# Altium schematic sheet [1]STM32F334R8T6Board_MCU.SchDoc
size B
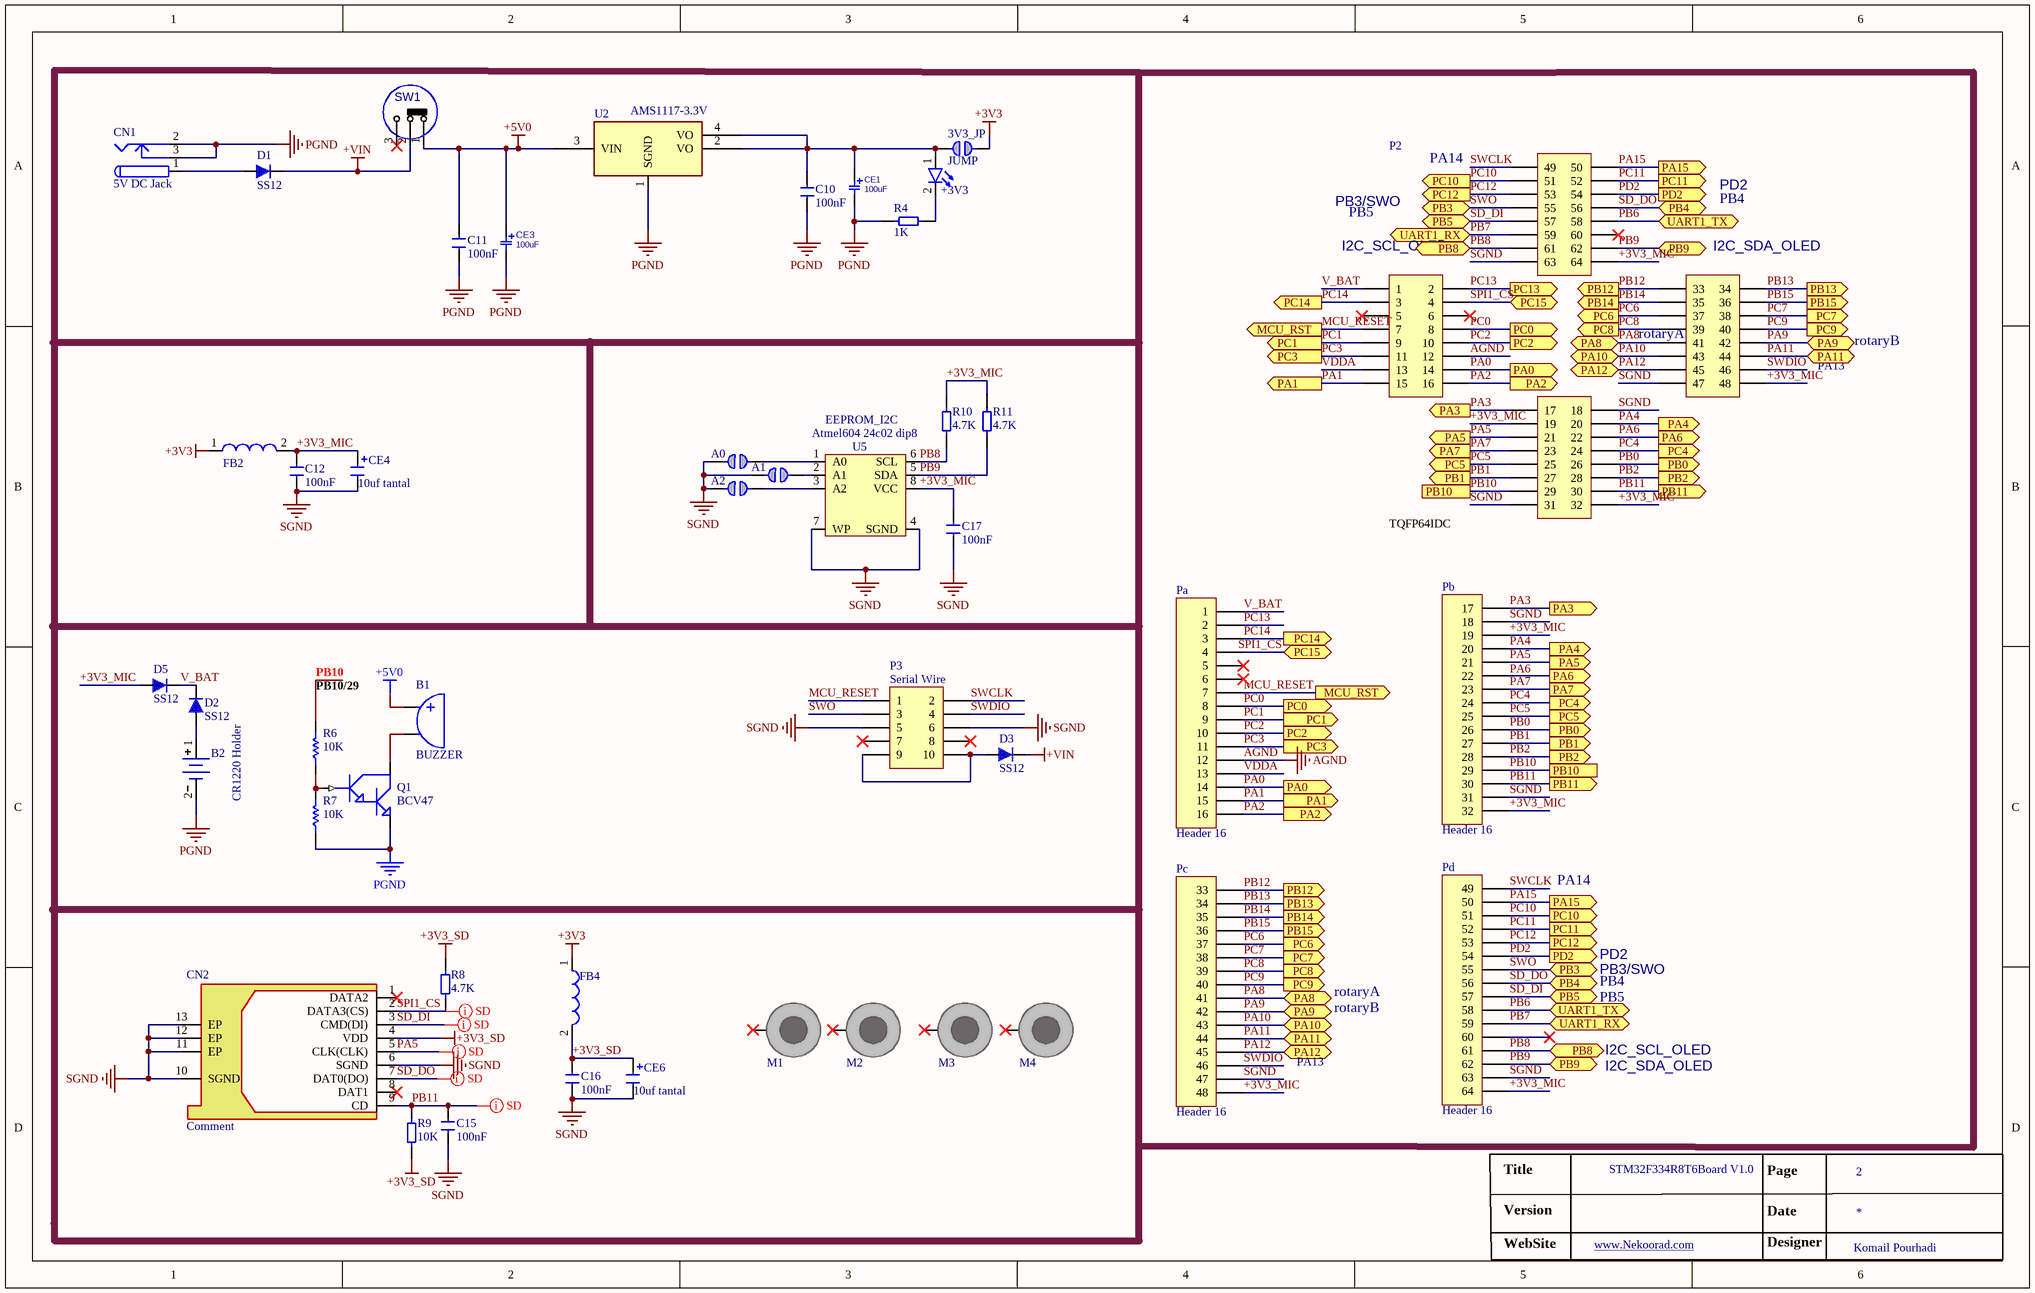
[diagram p0: [1]STM32F334R8T6Board_MCU.SchDoc]

## Parts
3V3_JP  JUMP  [RES_1206]
+3V3  HB  [LED SMD 1206]  (value not drawn)
A0  Comment  [HDR1X2]  (value not drawn)
A1  Comment  [HDR1X2]  (value not drawn)
A2  Comment  [HDR1X2]  (value not drawn)
B1  BUZZER  [BUZZ]
B2  CR1220 Holder  [Battery3]
C10  Comment  [SMD_CAP_1206]  (value not drawn)
C11  Comment  [SMD_CAP_1206]  (value not drawn)
C12  Comment  [SMD_CAP_1206]  (value not drawn)
C15  Comment  [SMD_CAP_1206]  (value not drawn)
C16  Comment  [SMD_CAP_1206]  (value not drawn)
C17  Comment  [SMD_CAP_1206]  (value not drawn)
CE1  value 100uF  [CAP-E-4]  (hidden comment: Comment)
CE3  value 100uF  [CAP-E-4]  (hidden comment: Comment)
CE4  10uf tantal  [cap-e-2]
CE6  10uf tantal  [cap-e-2]
CN1  5V DC Jack  [Power Jack]
CN2  Comment  [Micro sd csrd]
D1  SS12  [Diode SMA-M]
D2  SS12  [Diode SMA-M]
D3  SS12  [Diode SMA-M]
D5  SS12  [Diode SMA-M]
FB2  Comment  [r4p]  (value not drawn)
FB4  Comment  [r4p]  (value not drawn)
M1  Comment  [Stud-hole]  (value not drawn)  (no BOM)
M2  Comment  [Stud-hole]  (value not drawn)  (no BOM)
M3  Comment  [Stud-hole]  (value not drawn)  (no BOM)
M4  Comment  [Stud-hole]  (value not drawn)  (no BOM)
P2  TQFP64IDC  [tqfp64idc]
P3  Serial Wire  [IDC10-BOX]
Pa  Header 16  [HDR1X16]
Pb  Header 16  [HDR1X16]
Pc  Header 16  [HDR1X16]
Pd  Header 16  [HDR1X16]
Q1  BCV47  [SOT23_BEC_M]
R4  Comment  [RES_1206]  (value not drawn)
R6  10K  [RES_1206]
R7  10K  [RES_1206]
R8  Comment  [RES_1206]  (value not drawn)
R9  Comment  [RES_1206]  (value not drawn)
R10  Comment  [RES_1206]  (value not drawn)
R11  Comment  [RES_1206]  (value not drawn)
SW1  SlideSwitch  [HDR1X3]  (value not drawn)
U2  value AMS1117-3.3V  [MP04A_M]  (hidden comment: Comment)
U5  EEPROM_I2C  [dip8]

## Ports
MCU_RST (out), PA0 (out), PA1 (out), PA2 (out), PA3 (out), PA4 (out), PA5 (out), PA6 (out), PA7 (out), PA8 (bidir), PA9 (bidir), PA10 (bidir), PA11 (bidir), PA12 (bidir), PA15 (out), PB0 (out), PB1 (out), PB2 (out), PB3 (bidir), PB4 (bidir), PB5 (bidir), PB8 (bidir), PB9 (bidir), PB10, PB11 (out), PB12 (out), PB13 (out), PB14 (out), PB15 (out), PC0 (out), PC1 (out), PC2 (out), PC3 (out), PC4 (out), PC5 (out), PC6 (out), PC7 (out), PC8 (out), PC9 (out), PC10 (out), PC11 (out), PC12 (out), PC13 (out), PC14 (out), PC15 (bidir), PD2 (out), UART1_RX (bidir), UART1_TX (bidir)

## Nets
+3V3: 3V3_JP.2 FB2.1 FB4.1
+3V3_SD: C16.2 CE6.1 CN2.4(VDD) FB4.2 R8.1 R9.2
+5V0: B1.1 C11.2 CE3.1 SW1.1(P1) U2.3(VIN)
+VIN: D1.2(K) D3.2(K) SW1.2(P3)
AGND: P2.12 Pa.12
PGND: B2.2(-) C10.1 C11.1 CE1.2 CE3.2 CN1.2 CN1.3 Q1.2(E) R4.2 R7.1 U2.1(SGND)
SGND: A0.1 A1.1 A2.1 C12.1 C15.2 C16.1 C17.1 CE4.2 CE6.2 CN2.6(SGND) CN2.10(SGND) CN2.11(EP) CN2.12(EP) CN2.13(EP) P2.18 P2.31 P2.47 P2.63 P3.5 P3.6 Pb.18 Pb.31 Pc.47 Pd.63 U5.4(SGND) U5.7(WP)
+3V3_MIC: C12.2 C17.2 CE4.1 D5.1(A) FB2.2 P2.19 P2.32 P2.48 P2.64 Pb.19 Pb.32 Pc.48 Pd.64 R10.1 R11.1 U5.8(VCC)
MCU_RESET: P2.7 P3.1 Pa.7 ; port MCU_RST
PA0: P2.14 Pa.14 ; port PA0
PA1: P2.15 Pa.15 ; port PA1
PA2: P2.16 Pa.16 ; port PA2
PA3: P2.17 Pb.17 ; port PA3
PA4: P2.20 Pb.20 ; port PA4
PA5: CN2.5(CLK(CLK)) P2.21 Pb.21 ; port PA5
PA6: P2.22 Pb.22 ; port PA6
PA7: P2.23 Pb.23 ; port PA7
PA8: P2.41 Pc.41 ; port PA8
PA9: P2.42 Pc.42 ; port PA9
PA10: P2.43 Pc.43 ; port PA10
PA11: P2.44 Pc.44 ; port PA11
PA12: P2.45 Pc.45 ; port PA12
PA15: P2.50 Pd.50 ; port PA15
PB0: P2.26 Pb.26 ; port PB0
PB1: P2.27 Pb.27 ; port PB1
PB2: P2.28 Pb.28 ; port PB2
PB6: P2.58 Pd.58 ; port UART1_TX
PB7: P2.59 Pd.59 ; port UART1_RX
PB8: P2.61 Pd.61 R10.2 U5.6(SCL) ; port PB8
PB9: P2.62 Pd.62 R11.2 U5.5(SDA) ; port PB9
PB10: P2.29 Pb.29 R6.2 ; port PB10
PB11: C15.1 CN2.9(CD) P2.30 Pb.30 R9.1 ; port PB11
PB12: P2.33 Pc.33 ; port PB12
PB13: P2.34 Pc.34 ; port PB13
PB14: P2.35 Pc.35 ; port PB14
PB15: P2.36 Pc.36 ; port PB15
PC0: P2.8 Pa.8 ; port PC0
PC1: P2.9 Pa.9 ; port PC1
PC2: P2.10 Pa.10 ; port PC2
PC3: P2.11 Pa.11 ; port PC3
PC4: P2.24 Pb.24 ; port PC4
PC5: P2.25 Pb.25 ; port PC5
PC6: P2.37 Pc.37 ; port PC6
PC7: P2.38 Pc.38 ; port PC7
PC8: P2.39 Pc.39 ; port PC8
PC9: P2.40 Pc.40 ; port PC9
PC10: P2.51 Pd.51 ; port PC10
PC11: P2.52 Pd.52 ; port PC11
PC12: P2.53 Pd.53 ; port PC12
PC13: P2.2 Pa.2 ; port PC13
PC14: P2.3 Pa.3 ; port PC14
PD2: P2.54 Pd.54 ; port PD2
SD_DI: CN2.3(CMD(DI)) P2.57 Pd.57 ; port PB5
SD_DO: CN2.7(DAT0(DO)) P2.56 Pd.56 ; port PB4
SPI1_CS: CN2.2(DATA3(CS)) P2.4 Pa.4 R8.2 ; port PC15
SWCLK: P2.49 P3.2 Pd.49
SWDIO: P2.46 P3.4 Pc.46
SWO: P2.55 P3.3 Pd.55 ; port PB3
V_BAT: D2.2(K) D5.2(K) P2.1 Pa.1
VDDA: P2.13 Pa.13
Net3V3_JP_1: 3V3_JP.1 +3V3.1(A) C10.2 CE1.1 U2.2(VO) U2.4(VO)
Net+3V3_2: +3V3.2(K) R4.1
NetA0_2: A0.2 U5.1(A0)
NetA1_2: A1.2 U5.2(A1)
NetA2_2: A2.2 U5.3(A2)
NetB1_2: B1.2 Q1.3(C)
NetB2_1: B2.1(+) D2.1(A)
NetCN1_1: CN1.1 D1.1(A)
NetD3_1: D3.1(A) P3.9 P3.10
NetQ1_1: Q1.1(B) R6.1 R7.2

Not connected (* = marked no-connect by the designer): CN2 1(DATA2)* 8(DAT1)*; M1 1*; M2 1*; M3 1*; M4 1*; P2 5* 6* 60*; P3 7* 8*; Pa 5* 6*; Pd 60*; SW1 3(P4)*

## Layout directives
net class SD_card: PA5, PB11, SD_DI, SD_DO, SPI1_CS

## Notes on the sheet
- (near P2) PA14
- (near P2) PB3/SWO
- (near P2) PB5
- (near P2) PD2
- (near P2) PB4
- (near P2) I2C_SCL_OLED
- (near P2) I2C_SDA_OLED
- (near P2) rotaryA
- PA13
- rotaryB
- Atmel604 24c02 dip8
- PB10/29
- PA14
- PB3/SWO
- PD2
- rotaryA
- PB5
- PB4
- I2C_SCL_OLED
- I2C_SDA_OLED
- Title
- STM32F334R8T6Board V1.0
- Page
- 2
- Version
- WebSite
- www.Nekoorad.com <http://www.Nekoorad.com>
- Date
- Designer
- Komail Pourhadi
- Labels drawn without touching a wire or pin: PA6, SPI1_CS
- (in symbol Capacitor SMD) 100nF
- (in symbol Resistor SMD) 1K; 4.7K; 10K

## Library data of the parts
3V3_JP A0-A2 = jumper SMD
+3V3 = LED: Designer: Saeid Jorablo; Organazation: ControTec; Adding Date: 1387/12/22; Color: HB; Size: SMD 1206
B2 = Battry Backup
C10-C12 C15-C17 = Capacitor SMD
CE1 CE3 = CAP_THD_EL_10u25V: CAP, THD, ELEC, 10uF, 25V; MANF_P#: MANF_PART#; PARAM: 25V; MANF: MANF; PARAM2: PARAM2
CE4 CE6 = Capacitor Tantalium
CN1 = Power Jack
CN2 = Micro SD Card
D1-D3 D5 = 1N4001
FB2 FB4 = Ferrit Bead
M1-M4 = SCMH_M1P6: SCREW mouting, M1.6, 1.6mm diameter and 3.2mm PanHead; VALUE: DNP/MH; ASSEMBLY: DNP
P3 = Header 5X2: Header, 5-Pin, Dual row; LatestRevisionDate: 17-Jul-2002; LatestRevisionNote: Re-released for DXP Platform.; Publisher: Altium Limited
Pa Pb Pc Pd = Header 16: Header, 16-Pin; LatestRevisionDate: 17-Jul-2002; LatestRevisionNote: Re-released for DXP Platform.; Publisher: Altium Limited
Q1 = NPN DAR
R4 R8-R11 = Resistor SMD
R6 R7 = Resistor: Tolerance: 5%; Power: 1/8 W; Value: 10K
SW1 = SWSLIDT_SPDT_S_8X4: SWITCH, SLIDE, SPDT, 8.6X4.3mm, THD; MANF_PART#: OS102011MS2QN1; MANF: C&K; DESC: DESCRIPTION; VALUE: SlideSwitch; ASSEMBLY: ASSEMBLY; PARAM: PARAM; PRICE: 0.4$
U2 = VREG_1117_SOT223: REG, Linear, LDO1V, 0.8A, SOT-223; MANF_P#: LD1117, LM1117, AMS1117, TLV1117, REG1117, NCP1117, LT1117, SPX1117; MANF: TI, ON, ST; PARAM2: 1.2/1.5/1.8/2.5/2.85/3.3/5V; PARAM: LDO1V, 0.8A
U5 = AT24C128